# Altium project DriversBoard.PrjPcb
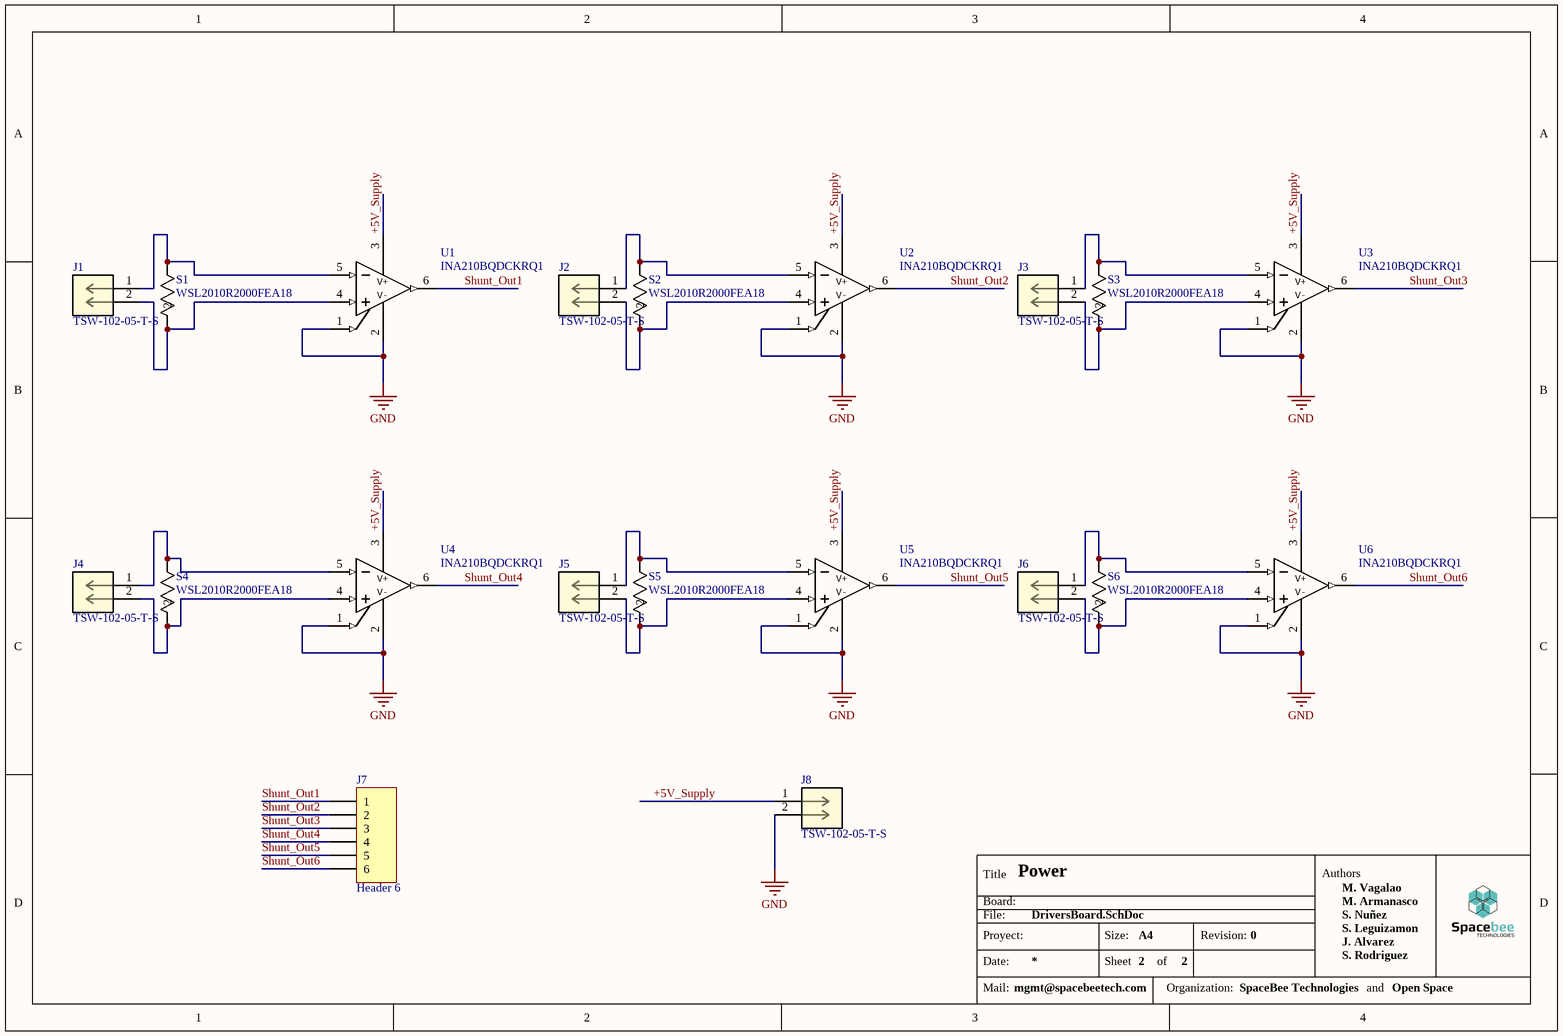
[diagram p0: DriversBoard.SchDoc]
2 sheets, 26 parts. Net scope: global (net labels, ports and power ports of the same name join across sheets).
Board files: DriversBoard.PcbDoc, DriversBoard_Bigger.PcbDoc
Sheets:
  DriversBoard.SchDoc
  DriverConectors.SchDoc

## Sheet DriversBoard.SchDoc: Power
size A4; CompanyName: SpaceBee Technologies; Organization: Open Space; Revision: 0; SheetNumber: 2; SheetTotal: 2; Mail: mgmt@spacebeetech.com; Project: Rovertito; ProjectName: Driver Board

### Parts
J1  TSW-102-05-T-S  [MOLEX_53261-0271]
J2  TSW-102-05-T-S  [MOLEX_53261-0271]
J3  TSW-102-05-T-S  [MOLEX_53261-0271]
J4  TSW-102-05-T-S  [MOLEX_53261-0271]
J5  TSW-102-05-T-S  [MOLEX_53261-0271]
J6  TSW-102-05-T-S  [MOLEX_53261-0271]
J7  Header 6  [MOLEX_532610671]
J8  TSW-102-05-T-S  [MOLEX_53261-0271]
S1  WSL2010R2000FEA18  [RC2010N_VIS]
S2  WSL2010R2000FEA18  [RC2010N_VIS]
S3  WSL2010R2000FEA18  [RC2010N_VIS]
S4  WSL2010R2000FEA18  [RC2010N_VIS]
S5  WSL2010R2000FEA18  [RC2010N_VIS]
S6  WSL2010R2000FEA18  [RC2010N_VIS]
U1  INA210BQDCKRQ1  [DCK0006A_L]
U2  INA210BQDCKRQ1  [DCK0006A_L]
U3  INA210BQDCKRQ1  [DCK0006A_L]
U4  INA210BQDCKRQ1  [DCK0006A_L]
U5  INA210BQDCKRQ1  [DCK0006A_L]
U6  INA210BQDCKRQ1  [DCK0006A_L]

### Nets
GND: J8.2 U1.1(REF) U1.2(GND) U2.1(REF) U2.2(GND) U3.1(REF) U3.2(GND) U4.1(REF) U4.2(GND) U5.1(REF) U5.2(GND) U6.1(REF) U6.2(GND)
+5V_Supply: J8.1 U1.3(V+) U2.3(V+) U3.3(V+) U4.3(V+) U5.3(V+) U6.3(V+)
Shunt_Out1: J7.1 U1.6(OUT)
Shunt_Out2: J7.2 U2.6(OUT)
Shunt_Out3: J7.3 U3.6(OUT)
Shunt_Out4: J7.4 U4.6(OUT)
Shunt_Out5: J7.5 U5.6(OUT)
Shunt_Out6: J7.6 U6.6(OUT)
NetJ1_1: J1.1 S1.1 U1.5(IN-)
NetJ1_2: J1.2 S1.2 U1.4(IN+)
NetJ2_1: J2.1 S2.1 U2.5(IN-)
NetJ2_2: J2.2 S2.2 U2.4(IN+)
NetJ3_1: J3.1 S3.1 U3.5(IN-)
NetJ3_2: J3.2 S3.2 U3.4(IN+)
NetJ4_1: J4.1 S4.1 U4.5(IN-)
NetJ4_2: J4.2 S4.2 U4.4(IN+)
NetJ5_1: J5.1 S5.1 U5.5(IN-)
NetJ5_2: J5.2 S5.2 U5.4(IN+)
NetJ6_1: J6.1 S6.1 U6.5(IN-)
NetJ6_2: J6.2 S6.2 U6.4(IN+)

### Notes on the sheet
- Title
- Board:
- File:
- Authors
- M. Armanasco
- S. Nuñez
- M. Vagalao
- Proyect:
- Date:
- Mail:
- Size:
- Sheet
- A4
- of
- Organization:
- Revision:
- S. Rodriguez
- S. Leguizamon
- J. Alvarez
- and
- (in symbol INA210BQDCKRQ1) V-

### Library data of the parts
J1-J6 J8 = TSW-102-05-T-S: No Description Available; Mfr_Name: Samtec Inc; Copyright: Copyright (C) 2022 Ultra Librarian. All rights reserved.; Manufacturer_Part_Number: TSW-102-05-T-S; Digi-Key_Part_Number_1: SAM1019-02-ND; Digi-Key_Part_Number_2: TSW-102-05-T-S-NDL; Digi-Key_Part_Number_3: 612-TSW-102-05-T-S-ND; RefDes: RefDes; Type: DEV
J7 = Header 6: Header, 6-Pin; LatestRevisionDate: 17-Jul-2002; LatestRevisionNote: Re-released for DXP Platform.; Publisher: Altium Limited
S1-S6 = WSL2010R2000FEA18: No Description Available; Mfr_Name: Vishay; Copyright: Copyright (C) 2022 Ultra Librarian. All rights reserved.; Manufacturer_Part_Number: WSL2010R2000FEA18; RefDes: RefDes; Type: DEV
U1-U6 = INA210BQDCKRQ1: No Description Available; Mfr_Name: Texas Instruments; Type: DEV; RefDes: RefDes; Copyright: Copyright (C) 2022 Ultra Librarian. All rights reserved.; Manufacturer_Part_Number: INA210BQDCKRQ1

## Sheet DriverConectors.SchDoc
size A4
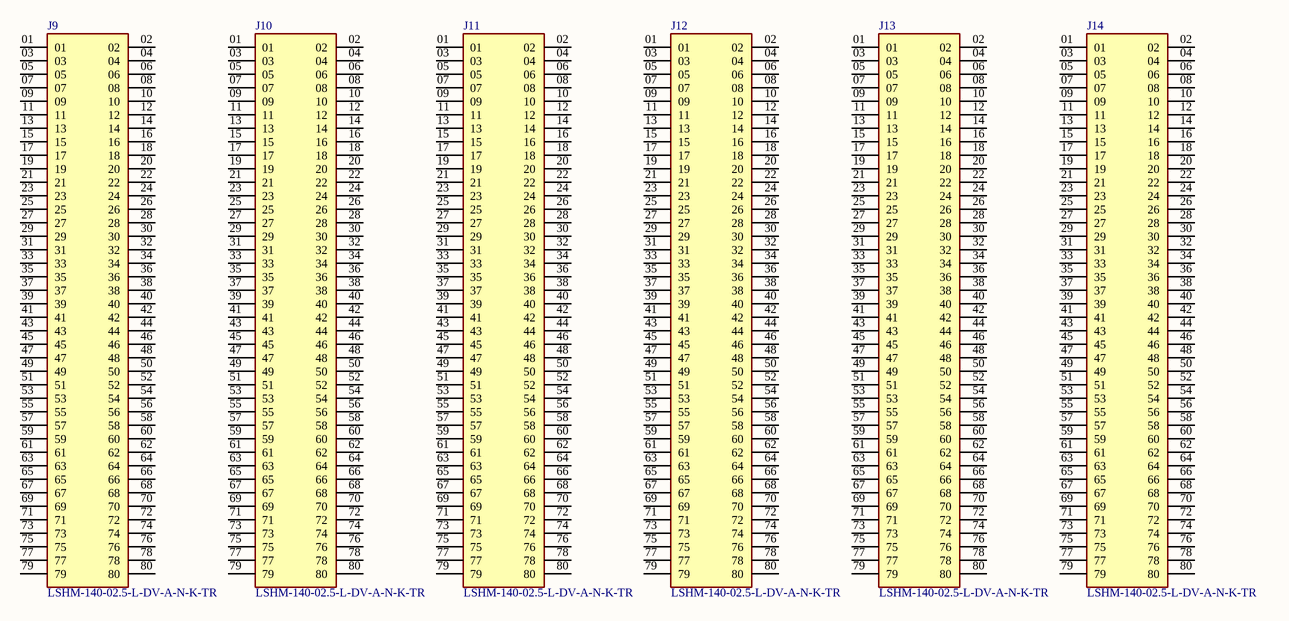
[diagram p1: DriverConectors.SchDoc]

### Parts
J9  LSHM-140-02.5-L-DV-A-N-K-TR  [SAMTEC_LSHM-140-02.5-L-DV-A-N-K-TR]
J10  LSHM-140-02.5-L-DV-A-N-K-TR  [SAMTEC_LSHM-140-02.5-L-DV-A-N-K-TR]
J11  LSHM-140-02.5-L-DV-A-N-K-TR  [SAMTEC_LSHM-140-02.5-L-DV-A-N-K-TR]
J12  LSHM-140-02.5-L-DV-A-N-K-TR  [SAMTEC_LSHM-140-02.5-L-DV-A-N-K-TR]
J13  LSHM-140-02.5-L-DV-A-N-K-TR  [SAMTEC_LSHM-140-02.5-L-DV-A-N-K-TR]
J14  LSHM-140-02.5-L-DV-A-N-K-TR  [SAMTEC_LSHM-140-02.5-L-DV-A-N-K-TR]

### Nets

Not connected (* = marked no-connect by the designer): J9 01 02 03 04 05 06 07 08 09 10 11 12 13 14 15 16 17 18 19 20 21 22 23 24 25 26 27 28 29 30 31 32 33 34 35 36 37 38 39 40 41 42 43 44 45 46 47 48 49 50 51 52 53 54 55 56 57 58 59 60 61 62 63 64 65 66 67 68 69 70 71 72 73 74 75 76 77 78 79 80; J10 01 02 03 04 05 06 07 08 09 10 11 12 13 14 15 16 17 18 19 20 21 22 23 24 25 26 27 28 29 30 31 32 33 34 35 36 37 38 39 40 41 42 43 44 45 46 47 48 49 50 51 52 53 54 55 56 57 58 59 60 61 62 63 64 65 66 67 68 69 70 71 72 73 74 75 76 77 78 79 80; J11 01 02 03 04 05 06 07 08 09 10 11 12 13 14 15 16 17 18 19 20 21 22 23 24 25 26 27 28 29 30 31 32 33 34 35 36 37 38 39 40 41 42 43 44 45 46 47 48 49 50 51 52 53 54 55 56 57 58 59 60 61 62 63 64 65 66 67 68 69 70 71 72 73 74 75 76 77 78 79 80; J12 01 02 03 04 05 06 07 08 09 10 11 12 13 14 15 16 17 18 19 20 21 22 23 24 25 26 27 28 29 30 31 32 33 34 35 36 37 38 39 40 41 42 43 44 45 46 47 48 49 50 51 52 53 54 55 56 57 58 59 60 61 62 63 64 65 66 67 68 69 70 71 72 73 74 75 76 77 78 79 80; J13 01 02 03 04 05 06 07 08 09 10 11 12 13 14 15 16 17 18 19 20 21 22 23 24 25 26 27 28 29 30 31 32 33 34 35 36 37 38 39 40 41 42 43 44 45 46 47 48 49 50 51 52 53 54 55 56 57 58 59 60 61 62 63 64 65 66 67 68 69 70 71 72 73 74 75 76 77 78 79 80; J14 01 02 03 04 05 06 07 08 09 10 11 12 13 14 15 16 17 18 19 20 21 22 23 24 25 26 27 28 29 30 31 32 33 34 35 36 37 38 39 40 41 42 43 44 45 46 47 48 49 50 51 52 53 54 55 56 57 58 59 60 61 62 63 64 65 66 67 68 69 70 71 72 73 74 75 76 77 78 79 80

### Library data of the parts
J9-J14 = LSHM-140-02.5-L-DV-A-N-K-TR: LSHM - Samtec 0.50mm Razor Beam High-Speed Hermaphroditic Terminal / Socket Strip.; Price: None; MP: LSHM-140-02.5-L-DV-A-N-K-TR; Availability: Unavailable; Value: *; Package: None